# Altium schematic sheet TPS54360_buck.SchDoc
size B; Organization: CWRUbotix; Address1: 10900 Euclid Avenue; Address2: Cleveland, OH 44106; Address3: USA
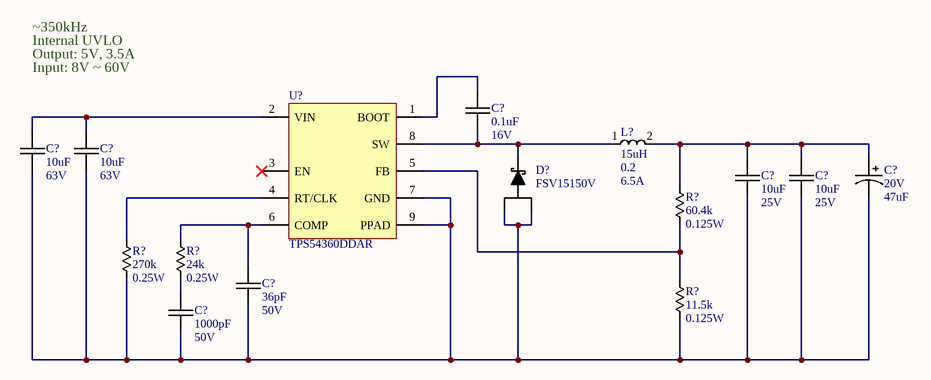
[diagram p0: TPS54360_buck.SchDoc]

## Parts
(Parts that share a designator on the sheet are numbered #1, #2 ... from top to bottom, then left to right.)
C?#1  Capacitance: 0.1uF  Voltage Rating: 16V  [chip_0603]  (hidden comment: cap_single_np)
C?#2  Capacitance: 10uF  Voltage Rating: 63V  [chip_1210]  (hidden comment: cap_single_np)
C?#3  Capacitance: 10uF  Voltage Rating: 63V  [chip_1210]  (hidden comment: cap_single_np)
C?#4  Capacitance: 10uF  Voltage Rating: 25V  [chip_1206]  (hidden comment: cap_single_np)
C?#5  Capacitance: 10uF  Voltage Rating: 25V  [chip_1206]  (hidden comment: cap_single_np)
C?#6  Voltage Rating: 20V  Capacitance: 47uF  [chip_2917]  (hidden comment: cap_single_p)
C?#7  Capacitance: 36pF  Voltage Rating: 50V  [chip_0603]  (hidden comment: cap_single_np)
C?#8  Capacitance: 1000pF  Voltage Rating: 50V  [chip_0603]  (hidden comment: cap_single_np)
D?  Manufacturer PN: FSV15150V  [TO-227-3]  (hidden comment: diode_sch_A12C3)
L?  Inductance: 15uH  Tolerance: 0.2  Current Rating: 6.5A  [7447709150]  (hidden comment: ind_0)
R?#1  Resistance: 60.4k  Power Rating: 0.125W  [chip_0805]  (hidden comment: res_single)
R?#2  Resistance: 270k  Power Rating: 0.25W  [chip_0603]  (hidden comment: res_single)
R?#3  Resistance: 24k  Power Rating: 0.25W  [chip_0603]  (hidden comment: res_single)
R?#4  Resistance: 11.5k  Power Rating: 0.125W  [chip_0805]  (hidden comment: res_single)
U?  Manufacturer PN: TPS54360DDAR  [SO-8_PPAD]  (hidden comment: TPS54360)

## Nets
NetC?#1_1: C?#1.1 U?.1(BOOT)
NetC?#1_2: C?#1.2 D?.3 L?.1 U?.8(SW)
NetC?#2_1: C?#2.1 C?#3.1 U?.2(VIN)
NetC?#2_2: C?#2.2 C?#3.2 C?#4.2 C?#5.2 C?#6.2 C?#7.2 C?#8.2 D?.1 D?.2 R?#2.2 R?#4.2 U?.7(GND) U?.9(PPAD)
NetC?#4_1: C?#4.1 C?#5.1 C?#6.1 L?.2 R?#1.1
NetC?#7_1: C?#7.1 R?#3.1 U?.6(COMP)
NetC?#8_1: C?#8.1 R?#3.2
NetR?#1_2: R?#1.2 R?#4.1 U?.5(FB)
NetR?#2_1: R?#2.1 U?.4(RT/CLK)

Not connected (* = marked no-connect by the designer): U? 3(EN)*

## Notes on the sheet
- ~350kHz
- Internal UVLO
- Output: 5V, 3.5A
- Input: 8V ~ 60V
- Title
- Size:
- B
- Number:
- Revision:
- Date:
- Sheet
- of

## Library data of the parts
C?#1 = CAP-00542: CAP, 0.1uF, ±10%, 16V, X7R, 0603; Manufacturer: Murata; Tolerance: ±10%; Part Number: CAP-00542; Type: X7R
C?#2 C?#3 = CAP-00554: CAP, 10uF, ±10%, 63V, X7R, 1210; Manufacturer: Samsung Electro-Mechanics; Manufacturer PN: CL32B106KMVNNWE; Tolerance: ±10%; Part Number: CAP-00554; Type: X7R; Cost: 0.81
C?#4 C?#5 = CAP-00539: CAP, 10uF, ±10%, 25V, X7R, 1206; Manufacturer: Samsung; Manufacturer PN: CL31B106KAHNNNE; Tolerance: ±10%; Part Number: CAP-00539; Type: X7R
C?#6 = CAP-00547: CAP, 47uF, ±10%, 20V, Tantalum; Manufacturer: AVX; Manufacturer PN: TAJD476K020RNJ; Tolerance: ±10%; Part Number: CAP-00547; Type: Tantalum; Cost: $0.83
C?#7 = CAP-00452: CAP, 36pF, ±2%, 50V, C0G, 0603; Manufacturer: Murata; Manufacturer PN: GRM1885C1H360GA01D; Tolerance: ±2%; Part Number: CAP-00452; Type: C0G
C?#8 = CAP-00465: CAP, 1000pF, ±2%, 50V, C0G, 0603; Manufacturer: Murata; Manufacturer PN: GRM1885C1H102GA01D; Tolerance: ±2%; Part Number: CAP-00465; Type: C0G
D? = DIO-00054: Dio, Schottky, 15A, 0.85V, 150V, TO-227; Manufacturer: ON Semi; Current Rating: 15A; Forward Voltage: 0.85V; Type: Schottky; Reverse Breakdown Voltage: 150V; Part Number: DIO-00054; Cost: 0.82
L? = MAG-00090: Ind, 15uH, 0.2, 6.5A, 7447709150; Manufacturer: Wurth; DCR: 26 mOhm; Part Number: MAG-00090; Manufacturer PN: 7447709150; Cost: 2.41
R?#1 = RES-00531: RES SMD 60.4K OHM 1% 1/8W 0805; Manufacturer: Rohm Semiconductor; Manufacturer PN: KTR10EZPF6042; Tolerance: 1%; Part Number: RES-00531
R?#2 = RES-00405: RES SMD 270K OHM 1% 1/4W 0603; Manufacturer: Panasonic; Manufacturer PN: ERJ-PA3F2703V; Tolerance: 1%; Part Number: RES-00405
R?#3 = RES-00399: RES SMD 24K OHM 1% 1/4W 0603; Manufacturer: Panasonic; Manufacturer PN: ERJ-PA3F2402V; Tolerance: 1%; Part Number: RES-00399
R?#4 = RES-00309: RES SMD 11.5K OHM 1% 1/8W 0805; Manufacturer: Rohm Semiconductor; Manufacturer PN: KTR10EZPF1152; Tolerance: 1%; Part Number: RES-00309
U? = PWREG-00017: REG, SW Buck Adj, 3.5A, 4.5-60V, 2.5MHz; Manufacturer: TI; Voltage Range Out: 0.8 - 58.8V; Max Current: 4.5A; Frequency: 100kHz-2.5MHz; Reg Type: SW Buck; Part Number: PWREG-00017; Voltage Range In: 4.5 - 60V; Fixed/Adj: Adj; Cost: 5.11